# EAGLE design opensda-shield (EAGLE 9.6.2)
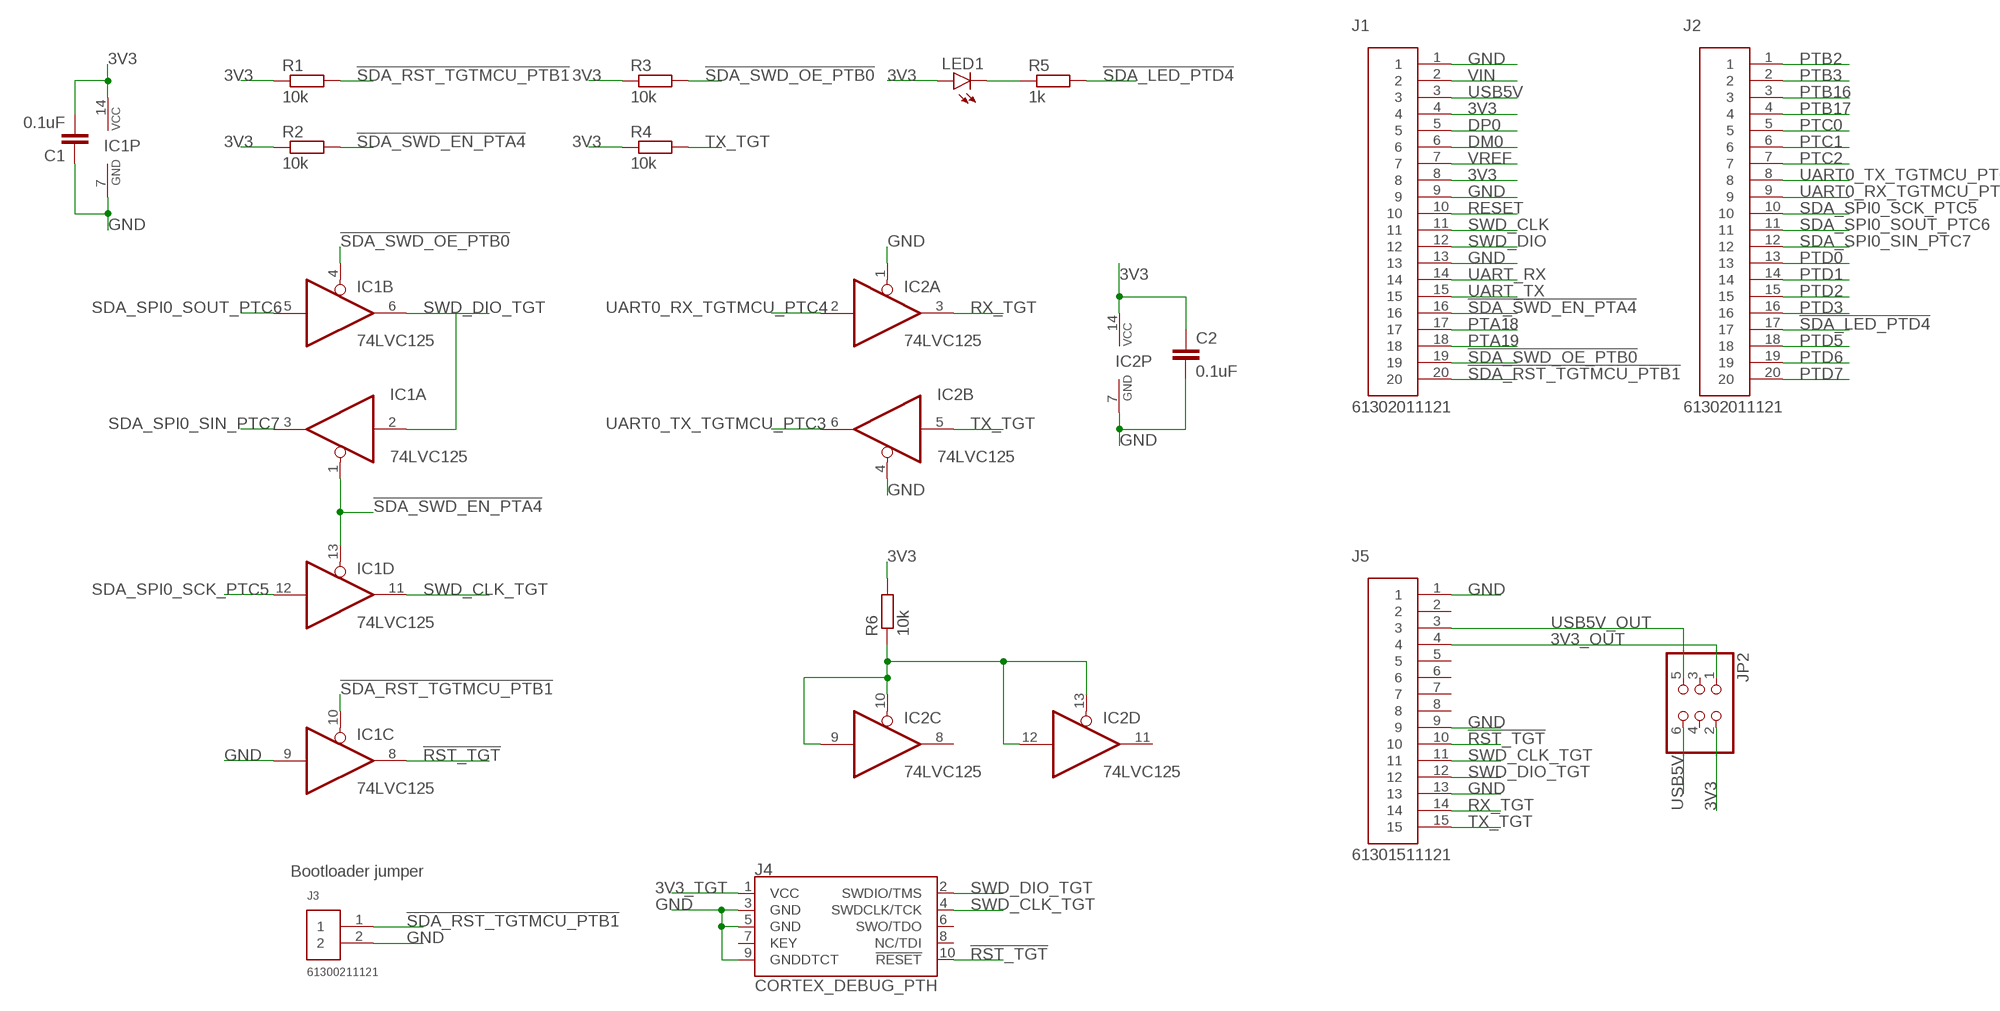
[diagram p0: schematic, sheet 1]

## Parts
C1  0.1uF  C-EUC0805  [C0805]
C2  0.1uF  C-EUC0805  [C0805]
IC1  74LVC125  74ABT125PW  [TSSOP14]
IC2  74LVC125  74ABT125PW  [TSSOP14]
J1  61302011121  [61302011121]
J2  61302011121  [61302011121]
J3  61300211121  [61300211121]
J4  CORTEX_DEBUG_PTH  [2X5-PTH-1.27MM]
J5  61301511121  [61301511121]
JP2  PINHD-2X3  [2X03]
LED1  LEDCHIPLED_0805  [CHIPLED_0805]
R1  10k  R-EU_R0805  [R0805]
R2  10k  R-EU_R0805  [R0805]
R3  10k  R-EU_R0805  [R0805]
R4  10k  R-EU_R0805  [R0805]
R5  1k  R-EU_R0805  [R0805]
R6  10k  R-EU_R0805  [R0805]

## Nets
3V3: C1.2 C2.1 IC1.14(P:VCC) IC2.14(P:VCC) J1.4 J1.8 JP2.2 LED1.A R1.1 R2.1 R3.1 R4.1 R6.2
3V3_OUT: J5.4 JP2.1
3V3_TGT: J4.1(VCC)
!RST_TGT: IC1.8(C:O) J4.10(!RESET) J5.10
!SDA_LED_PTD4: J2.17 R5.2
!SDA_RST_TGTMCU_PTB1: IC1.10(C:OE) J1.20 J3.1 R1.2
!SDA_SWD_EN_PTA4: IC1.1(A:OE) IC1.13(D:OE) J1.16 R2.2
!SDA_SWD_OE_PTB0: IC1.4(B:OE) J1.19 R3.2
DM0: J1.6
DP0: J1.5
GND: C1.1 C2.2 IC1.7(P:GND) IC1.9(C:I) IC2.1(A:OE) IC2.4(B:OE) IC2.7(P:GND) J1.1 J1.9 J1.13 J3.2 J4.3(GND) J4.5(GND) J4.9(GNDDTCT) J5.1 J5.9 J5.13
N$2: LED1.C R5.1
N$5: IC2.9(C:I) IC2.10(C:OE) IC2.12(D:I) IC2.13(D:OE) R6.1
PTA18: J1.17
PTA19: J1.18
PTB2: J2.1
PTB3: J2.2
PTB16: J2.3
PTB17: J2.4
PTC0: J2.5
PTC1: J2.6
PTC2: J2.7
PTD0: J2.13
PTD1: J2.14
PTD2: J2.15
PTD3: J2.16
PTD5: J2.18
PTD6: J2.19
PTD7: J2.20
RESET: J1.10
RX_TGT: IC2.3(A:O) J5.14
SDA_SPI0_SCK_PTC5: IC1.12(D:I) J2.10
SDA_SPI0_SIN_PTC7: IC1.3(A:O) J2.12
SDA_SPI0_SOUT_PTC6: IC1.5(B:I) J2.11
SWD_CLK: J1.11
SWD_CLK_TGT: IC1.11(D:O) J4.4(SWDCLK/TCK) J5.11
SWD_DIO: J1.12
SWD_DIO_TGT: IC1.2(A:I) IC1.6(B:O) J4.2(SWDIO/TMS) J5.12
TX_TGT: IC2.5(B:I) J5.15 R4.2
UART0_RX_TGTMCU_PTC4: IC2.2(A:I) J2.9
UART0_TX_TGTMCU_PTC3: IC2.6(B:O) J2.8
UART_RX: J1.14
UART_TX: J1.15
USB5V: J1.3 JP2.6
USB5V_OUT: J5.3 JP2.5
VIN: J1.2
VREF: J1.7
Unconnected: IC2.8(C:O) IC2.11(D:O) J4.6(SWO/TDO) J4.7(KEY) J4.8(NC/TDI) J5.2 J5.5 J5.6 J5.7 J5.8 JP2.3 JP2.4

## Notes on the sheet
- Bootloader jumper

## Library data of the parts
C1 C2 = rcl:C-EU: CAPACITOR, European symbol; SPICEPREFIX: C
IC1 IC2 = 74xx-eu:74*125: Quad bus BUFFER, 3-state
J1 J2 = Headers:61302011121: CONN HEADER VERT 20POS 2.54MM Manufacturer's datasheet <https://katalog.we-online.de/em/datasheet/6130xx11121.pdf>; CREATED_BY: PCBLayout.com; DIGIKEY_PART_NUMBER: 732-5329-ND; MANUFACTURER: Wurth Electronics Inc.; MPN: 61302011121
J3 = Headers:61300211121: CONN HEADER VERT 2POS 2.54MM Manufacturer's datasheet <https://katalog.we-online.de/em/datasheet/6130xx11121.pdf>; CREATED_BY: PCBLayout.com; DIGI_KEY_PART_NUMBER: 732-5315-ND; MANUFACTURER: Wurth Electronics Inc.; MPN: 61300211121
J4 = SparkFun-Connectors:CORTEX_DEBUG: Cortex Debug Connector - 10 pin Supports JTAG debug, Serial Wire debug, and Serial Wire Viewer. PTH and SMD connector options available. General Connector Information <http://infocenter.arm.com/help/topic/com.arm.doc.faqs/attached/13634/cortex_debug_connectors.pdf> Products: PTH Connector <http://www.digikey.com/product-detail/en/cnc-tech/3220-10-0100-00/1175-1627-ND/3883661> -via Digi-Key SparkFun PSoc <https://www.sparkfun.com/products/13229> SparkFun T <https://www.sparkfun.com/products/13810>
J5 = Headers:61301511121: CONN HEADER VERT 15POS 2.54MM Manufacturer's datasheet <https://katalog.we-online.de/em/datasheet/6130xx11121.pdf>; CREATED_BY: PCBLayout.com; DIGIKEY_PART_NUMBER: 732-5326-ND; MANUFACTURER: Wurth Electronics Inc.; MPN: 61301511121
JP2 = pinhead:PINHD-2X3: PIN HEADER
LED1 = led:LED: LED OSRAM: - CHIPLED LG R971, LG N971, LY N971, LG Q971, LY Q971, LO R971, LY R971 LH N974, LH R974 LS Q976, LO Q976, LY Q976 LO Q996 - Hyper CHIPLED LW Q18S LB Q993, LB Q99A, LB R99A - SideLED LS A670, LO A670, LY A670, LG A670, LP A670 LB A673, LV A673, LT A673, LW A673 LH A674 LY A675 LS A676, LA A676, LO A676, LY A676, LW A676 LS A679, LY A679, LG A679 - Hyper Micro SIDELED® LS Y876, LA Y876, LO Y876, LY Y876 LT Y87S - SmartLED LW L88C, LW L88S LB L89C, LB L89S, LG L890 LS L89K, LO L89K, LY L89K LS L896, LA L896, LO L896, LY L896 - TOPLED LS T670, LO T670, LY T670, LG T670, LP T670 LSG T670, LSP T670, LSY T670, LOP T670, LYG T670 LG T671, LOG T671, LSG T671 LB T673, LV T673, LT T673, LW T673 LH T674 LS T676, LA T676, LO T676, LY T676, LB T676, LH T676, LSB T676, LW T676 LB T67C, LV T67C, LT T67C, LS T67K, LO T67K, LY T67K, LW E67C LS E67B, LA E67B, LO E67B, LY E67B, LB E67C, LV E67C, LT E67C LW T67C LS T679, LY T679, LG T679 LS T770, LO T770, LY T770, LG T770, LP T770 LB T773, LV T773, LT T773, LW T773 LH T774 LS E675, LA E675, LY E675, LS T675 LS T776, LA T776, LO T776, LY T776, LB T776 LHGB T686 LT T68C, LB T68C - Hyper Mini TOPLED® LB M676 - Mini TOPLED Santana® LG M470 LS M47K, LO M47K, LY M47K Source: http://www.osram.convergy.de LUXEON: - LUMILED® LXK2-PW12-R00, LXK2-PW12-S00, LXK2-PW14-U00, LXK2-PW14-V00 LXK2-PM12-R00, LXK2-PM12-S00, LXK2-PM14-U00 LXK2-PE12-Q00, LXK2-PE12-R00, LXK2-PE12-S00, LXK2-PE14-T00, LXK2-PE14-U00 LXK2-PB12-K00, LXK2-PB12-L00, LXK2-PB12-M00, LXK2-PB14-N00, LXK2-PB14-P00, LXK2-PB14-Q00 LXK2-PR12-L00, LXK2-PR12-M00, LXK2-PR14-Q00, LXK2-PR14-R00 LXK2-PD12-Q00, LXK2-PD12-R00, LXK2-PD12-S00 LXK2-PH12-R00, LXK2-PH12-S00 LXK2-PL12-P00, LXK2-PL12-Q00, LXK2-PL12-R00 Source: www.luxeon.com KINGBRIGHT: KA-3528ASYC Source: www.kingbright.com
R1-R6 = rcl:R-EU_: RESISTOR, European symbol; SPICEPREFIX: R

## Board
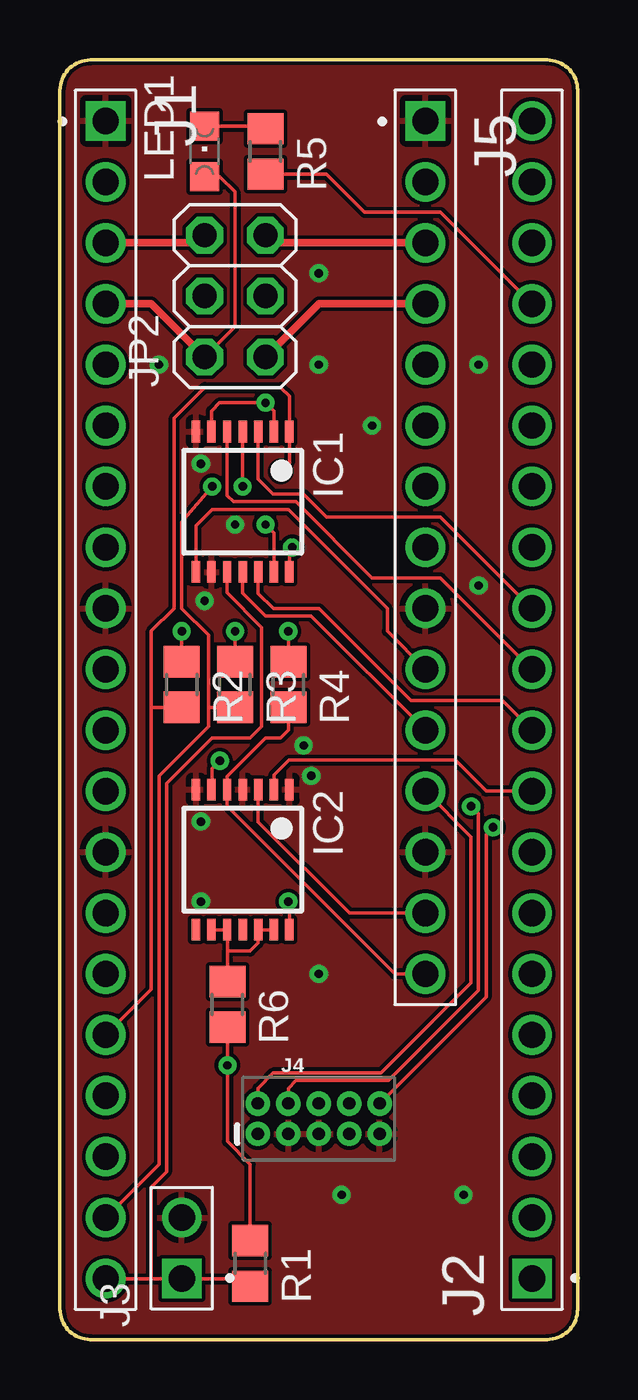
[diagram p1: board, top side]
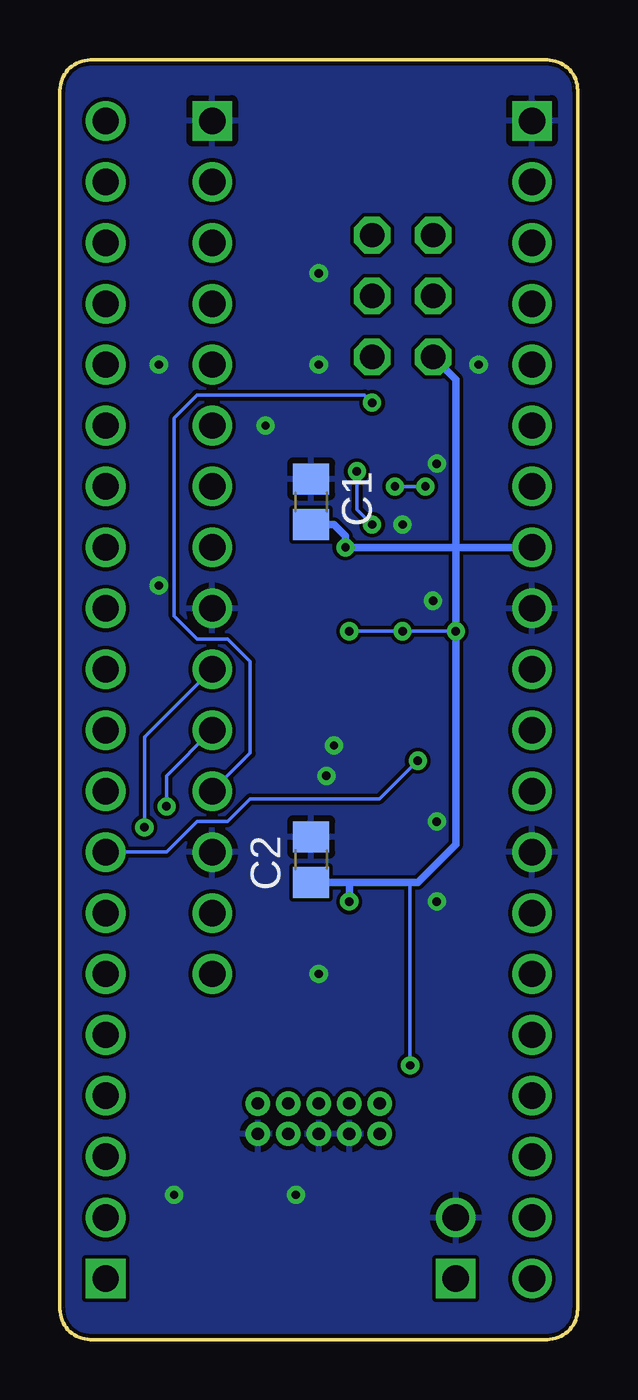
[diagram p2: board, bottom side, seen from below]

Size 21.59 x 53.34 mm. Coordinates in mm from the lower left corner, seen from the top.
Outline: 21.59,1.27 21.59,52.07 arc90 20.32,53.34 1.27,53.34 arc90 0,52.07 0,1.27 arc90 1.27,0 20.32,0 arc90 21.59,1.27
Copper layers (1*16): Top 0.035mm / dielectric 1.5mm / Bottom 0.035mm
Design rules "default *": minimum track width 6mil, minimum drill 0.35mm, track to track 6mil, track to pad 6mil, pad to pad 6mil, via to via 6mil, smd to smd 6mil, copper to edge 6mil, drill to drill 6mil, minimum pad ring 10mil, minimum via ring 8mil, stop-mask expansion 4mil, vias tented up to drill 0mil, thermal gap 10mil

### Footprints (pad centres in the part's own frame; a part is rotated, then mirrored left to right if it is on the bottom)
C0805 = smd 1.3 x 1.5: 1 -0.95,0; 2 0.95,0
TSSOP14 = smd 0.35 x 0.9: 1 -1.95,-2.925; 2 -1.3,-2.925; 3 -0.65,-2.925; 4 0,-2.925; 5 0.65,-2.925; 6 1.3,-2.925; 7 1.95,-2.925; 8 1.95,2.925; 9 1.3,2.925; 10 0.65,2.925; 11 0,2.925; 12 -0.65,2.925; 13 -1.3,2.925; 14 -1.95,2.925
61302011121 = drill 1.1 square: 1 -24.13,0 | drill 1.1: 2 -21.59,0; 3 -19.05,0; 4 -16.51,0; 5 -13.97,0; 6 -11.43,0; 7 -8.89,0; 8 -6.35,0; 9 -3.81,0; 10 -1.27,0; 11 1.27,0; 12 3.81,0; 13 6.35,0; 14 8.89,0; 15 11.43,0; 16 13.97,0; 17 16.51,0; 18 19.05,0; 19 21.59,0; 20 24.13,0
61300211121 = drill 1.1 square: 1 -1.27,0 | drill 1.1: 2 1.27,0
2X5-PTH-1.27MM = drill 0.508 pad 1: 1 -2.54,-0.635; 2 -2.54,0.635; 3 -1.27,-0.635; 4 -1.27,0.635; 5 0,-0.635; 6 0,0.635; 7 1.27,-0.635; 8 1.27,0.635; 9 2.54,-0.635; 10 2.54,0.635
61301511121 = drill 1.1 square: 1 -17.78,0 | drill 1.1: 2 -15.24,0; 3 -12.7,0; 4 -10.16,0; 5 -7.62,0; 6 -5.08,0; 7 -2.54,0; 8 0,0; 9 2.54,0; 10 5.08,0; 11 7.62,0; 12 10.16,0; 13 12.7,0; 14 15.24,0; 15 17.78,0
2X03 = drill 1.016 octagon: 1 -2.54,-1.27; 2 -2.54,1.27; 3 0,-1.27; 4 0,1.27; 5 2.54,-1.27; 6 2.54,1.27
CHIPLED_0805 = smd 1.2 x 1.2: A 0,-1.05; C 0,1.05
R0805 = smd 1.3 x 1.5: 1 -0.95,0; 2 0.95,0

### Placement (x,y rotation side)
C1  11.11,34.92 270 bottom
C2  11.11,20 90 bottom
IC1  7.62,34.92 180 top
IC2  7.62,20 180 top
J1  1.91,26.67 270 top
J2  19.68,26.67 90 top
J3  5.08,3.81 90 top
J4  10.79,9.21 0 top
J5  15.24,33.02 270 top
JP2  7.3,43.5 90 top
LED1  6.03,49.53 0 top
R1  7.94,3.17 270 top
R2  5.08,27.3 270 top
R3  7.3,27.3 270 top
R4  9.53,27.3 270 top
R5  8.57,49.53 270 top
R6  6.99,13.97 270 top

### Tracks (layer width: path | path; a pad name or v marks a point on that pad's centre or on a via)
3V3  (via drill 0.35)
  Top 0.152: LED1.A 6.67,48.48 7.3,47.84 7.3,42.23 JP2.2 | IC2.14 9.57,18.21 v9.53,18.26 | IC1.14 9.57,32.91 v9.68,33.02 | R2.1 v5.08,29.53 | R3.1 v7.3,29.53 | R4.1 v9.53,29.53 | R6.2 v6.99,11.43 6.99,8.25 7.94,7.3 R1.1
  Top 0.305: J1.4 3.81,43.18 JP2.2
  Bottom 0.152: v5.08,29.53 v7.3,29.53 v9.53,29.53 | v6.99,11.43 6.99,19.05
  Bottom 0.305: 5.08,33.02 v5.08,29.53 5.08,20.64 6.67,19.05 6.99,19.05 9.53,19.05 | 5.08,33.02 v9.68,33.02 9.68,33.5 10.16,33.98 C1.2 | C2.1 9.85,19.05 9.84,19.05 9.53,19.05 | v9.53,18.26 9.53,19.05 | J1.8 5.08,33.02 | 5.08,33.02 5.08,40.01 JP2.2
3V3_OUT
  Top 0.305: J5.4 10.79,43.18 JP2.1
!RST_TGT  (via drill 0.35)
  Top 0.152: J4.10 17.78,14.28 17.78,21.06 v18.07,21.35 | IC1.8 5.67,33.93 6.35,34.61 9.53,34.61 13.65,30.48 13.65,29.53 J5.10
  Bottom 0.152: v18.07,21.35 18.07,25.11 J5.10
!SDA_LED_PTD4
  Top 0.152: R5.2 11.11,48.58 12.7,46.99 15.88,46.99 J2.17
!SDA_RST_TGTMCU_PTB1
  Top 0.152: R1.2 7.62,2.54 J3.1 3.81,2.54 | J1.20 3.81,2.54 | IC1.10 6.97,31.13 8.41,29.69 8.41,25.56 7.94,25.08 6.35,25.08 4.45,23.18 4.45,6.99 3.81,6.35 3.81,2.54
!SDA_SWD_EN_PTA4  (via drill 0.35)
  Top 0.152: IC1.13 8.92,33.62 v8.57,33.97 | v9.21,36.2 9.57,36.56 IC1.1 9.57,39.33 9.21,39.69 6.03,39.69 4.76,38.42 4.76,30.48 3.81,29.53 3.81,26.35 | J1.16 3.81,14.61 3.81,26.35 | R2.2 3.81,26.35
  Bottom 0.152: v8.57,33.97 9.21,34.61 v9.21,36.2
!SDA_SWD_OE_PTB0  (via drill 0.35)
  Top 0.152: v6.35,35.56 5.08,34.08 5.08,30.48 6.19,29.37 6.19,26.35 | v7.62,35.56 IC1.4 | 6.19,26.35 6.19,25.56 4.13,23.5 4.13,7.3 J1.19 | R3.2 6.19,26.35
  Bottom 0.152: v6.35,35.56 v7.62,35.56
GND  (via drill 0.35)
  other vias: 10.79,44.45 10.79,40.64 5.87,36.51 4.13,40.64 7.3,33.97 6.03,30.8 17.46,40.64 10.48,23.5 5.87,21.59 10.79,15.24 11.75,6.03 16.83,6.03 17.46,31.43 5.87,18.26 10.16,24.77 13.02,38.1
  pour Top: -0.64,53.98 -0.64,-1.27 22.23,-1.27 22.23,53.98
  pour Bottom: -0.64,53.98 -0.64,-2.22 22.23,-2.22 22.23,53.98
N$2
  Top 0.152: LED1.C 8.57,50.58 R5.1
N$5
  Top 0.152: IC2.9 IC2.10 6.99,17.06 6.99,16.19 | R6.1 6.99,16.19 | IC2.13 IC2.12 8.27,16.52 7.94,16.19 6.99,16.19
RX_TGT
  Top 0.152: J5.14 12.06,17.78 8.27,21.57 IC2.3
SDA_SPI0_SCK_PTC5
  Top 0.152: J2.10 18.45,26.64 14.64,26.64 10.81,30.47 8.9,30.47 8.27,31.1 IC1.12
SDA_SPI0_SIN_PTC7
  Top 0.152: IC1.3 8.27,35.86 8.89,35.24 10.16,35.24 11.11,34.29 15.88,34.29 J2.12
SDA_SPI0_SOUT_PTC6
  Top 0.152: IC1.5 6.97,35.19 7.23,34.92 9.84,34.92 13.02,31.75 15.88,31.75 J2.11
SWD_CLK_TGT  (via drill 0.35)
  Top 0.152: IC1.11 7.62,31.11 8.57,30.16 10.48,30.16 J5.11 | J4.4 9.53,10.48 9.84,10.79 13.69,10.79 17.45,14.55 17.45,21.92 v17.14,22.23
  Bottom 0.152: J5.11 17.14,23.5 v17.14,22.23
SWD_DIO_TGT  (via drill 0.35)
  Top 0.152: J4.2 8.26,10.48 8.89,11.11 13.39,11.11 17.14,14.87 17.14,20.95 J5.12 | IC1.6 6.32,38.7 6.67,39.05 v8.57,39.05 8.92,38.7 IC1.2
  Bottom 0.152: J5.12 13.65,24.45 13.65,28.26 14.61,29.21 15.88,29.21 16.83,30.16 16.83,38.42 15.88,39.37 8.89,39.37 v8.57,39.05
TX_TGT
  Top 0.152: J5.15 13.97,15.24 6.97,22.24 IC2.5 6.97,23.48 8.57,25.08 9.21,25.08 9.53,25.4 R4.2
UART0_RX_TGTMCU_PTC4
  Top 0.152: J2.9 17.78,22.86 16.49,24.15 9.54,24.15 8.92,23.52 IC2.2
UART0_TX_TGTMCU_PTC3  (via drill 0.35)
  Top 0.152: IC2.6 6.35,22.96 6.35,23.81 v6.67,24.13
  Bottom 0.152: J2.8 17.14,20.32 15.88,21.59 14.61,21.59 13.65,22.54 8.26,22.54 v6.67,24.13
USB5V
  Top 0.305: J1.3 5.71,45.72 JP2.6
USB5V_OUT
  Top 0.305: JP2.5 8.89,45.72 J5.3

### Text on the board
bStop: JV & poli 2022
Popis: SDA_LED | GND | 5V | 3V3 | GND | RST | CLK | DIO | GND | RX | TX | 1 | BOOT | OpenSDA / shield v1.1